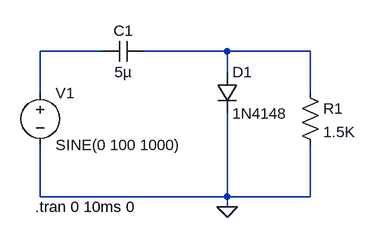
[diagram p0: schematic Positive and Negative Clamper.asc]
Positive and Negative Clamper.asc, the LTspice schematic file:
Version 4
SHEET 1 880 680
WIRE 320 208 224 208
WIRE 512 208 384 208
WIRE 640 208 512 208
WIRE 512 240 512 208
WIRE 224 272 224 208
WIRE 640 272 640 208
WIRE 224 432 224 352
WIRE 512 432 512 304
WIRE 512 432 224 432
WIRE 640 432 640 352
WIRE 640 432 512 432
WIRE 512 448 512 432
FLAG 512 448 0
SYMBOL voltage 224 256 R0
SYMATTR InstName V1
SYMATTR Value SINE(0 100 1000)
SYMBOL cap 384 192 R90
WINDOW 0 0 32 VBottom 2
WINDOW 3 32 32 VTop 2
SYMATTR InstName C1
SYMATTR Value 5µ
SYMBOL res 624 256 R0
SYMATTR InstName R1
SYMATTR Value 1.5K
SYMBOL diode 496 240 R0
SYMATTR InstName D1
SYMATTR Value 1N4148
TEXT 216 448 Left 2 !.tran 0 10ms 0

The netlist it stands for:
* Positive and Negative Clamper.asc
V1 N001 0 SINE(0 100 1000)
C1 N002 N001 5µ
R1 N002 0 1.5K
D1 N002 0 1N4148
.model D D
.lib standard.dio
.tran 0 10ms 0
.backanno
.end